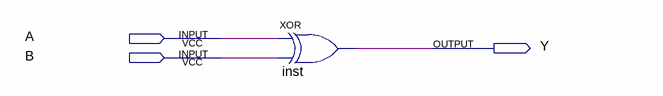
[diagram p0: schematic sheet]
// Quartus schematic CONG_XOR.bdf as structural Verilog: 1 symbols, 3 pins
module CONG_XOR (
  input  A,
  input  B,
  output Y
);

  xor inst (Y, A, B);
endmodule
